# EAGLE design char (EAGLE 9.1.0)
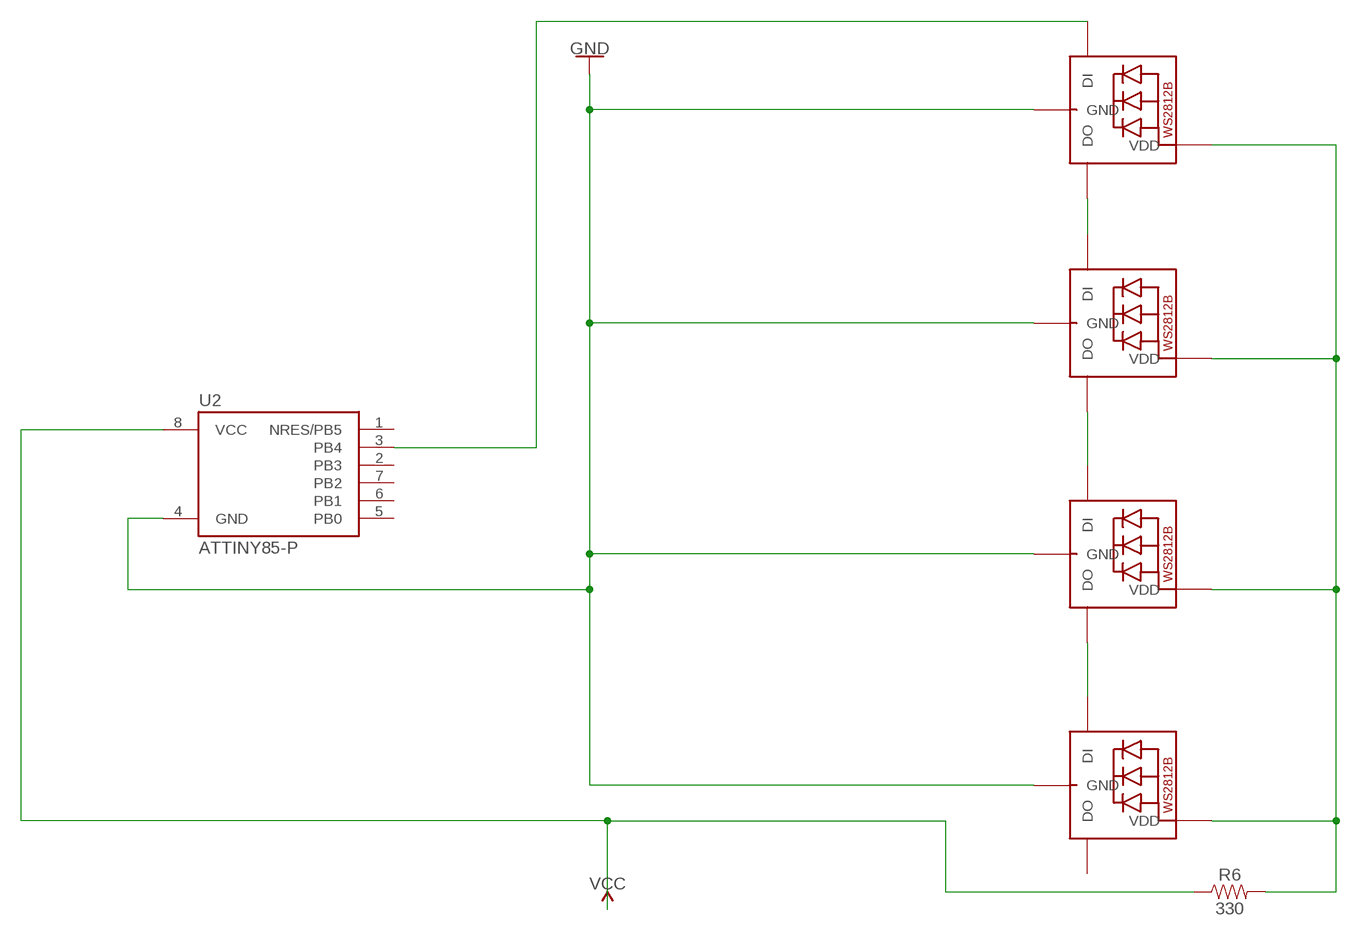
[diagram p0: schematic, sheet 1]

## Parts
R6  330  330OHM-HORIZ-1/10W-5%  [AXIAL-0.3]
U2  ATTINY85-P  [PDIP08_300MIL]
U$1  THROHOLE  [LED5MMRGB]
U$2  THROHOLE  [LED5MMRGB]
U$3  THROHOLE  [LED5MMRGB]
U$4  THROHOLE  [LED5MMRGB]

## Nets
GND: U2.4(GND) U$1.2(GND) U$2.2(GND) U$3.2(GND) U$4.2(GND)
N$1: U2.3(PB4) U$4.1(DI)
N$2: U$1.1(DI) U$4.4(DO)
N$3: U$1.4(DO) U$2.1(DI)
N$4: U$2.4(DO) U$3.1(DI)
N$5: R6.P$2 U$1.3(VDD) U$2.3(VDD) U$3.3(VDD) U$4.3(VDD)
VCC: R6.P$1 U2.8(VCC)
Unconnected: U2.1(NRES/PB5) U2.2(PB3) U2.5(PB0) U2.6(PB1) U2.7(PB2) U$3.4(DO)

## Library data of the parts
R6 = SparkFun-Resistors:330OHM: 330Ω resistor A resistor is a passive two-terminal electrical component that implements electrical resistance as a circuit element. Resistors act to reduce current flow, and, at the same time, act to lower voltage levels within circuits. - Wikipedia; PROD_ID: RES-8371
U2 = _hhn_attiny25_45_85:ATTINY85*: ATMEL ATtiny 85 Packages: P = PDIP 08 30mil S = SOIC 08 EIAJ 208mil Technologies Note: for complete ordering code (temp. range, finish, tape&reel etc.) see www.atmel.com • Supply Voltage: V = (1.8…5.5)V | [blank] = (2.7…5.5)V • Speed: 10 = 10 MHz | 20 = 20 MHz Author: Dipl.-Ing. FH Rainer Bayer HHN Hochschule Heilbronn (Heilbronn University), rainer.bayer@hs-heilbronn.de Ingenieurbüro ing-rb, mail@ing-rb.de
U$1-U$4 = neopixalthrohole:THROHOLE

## Board
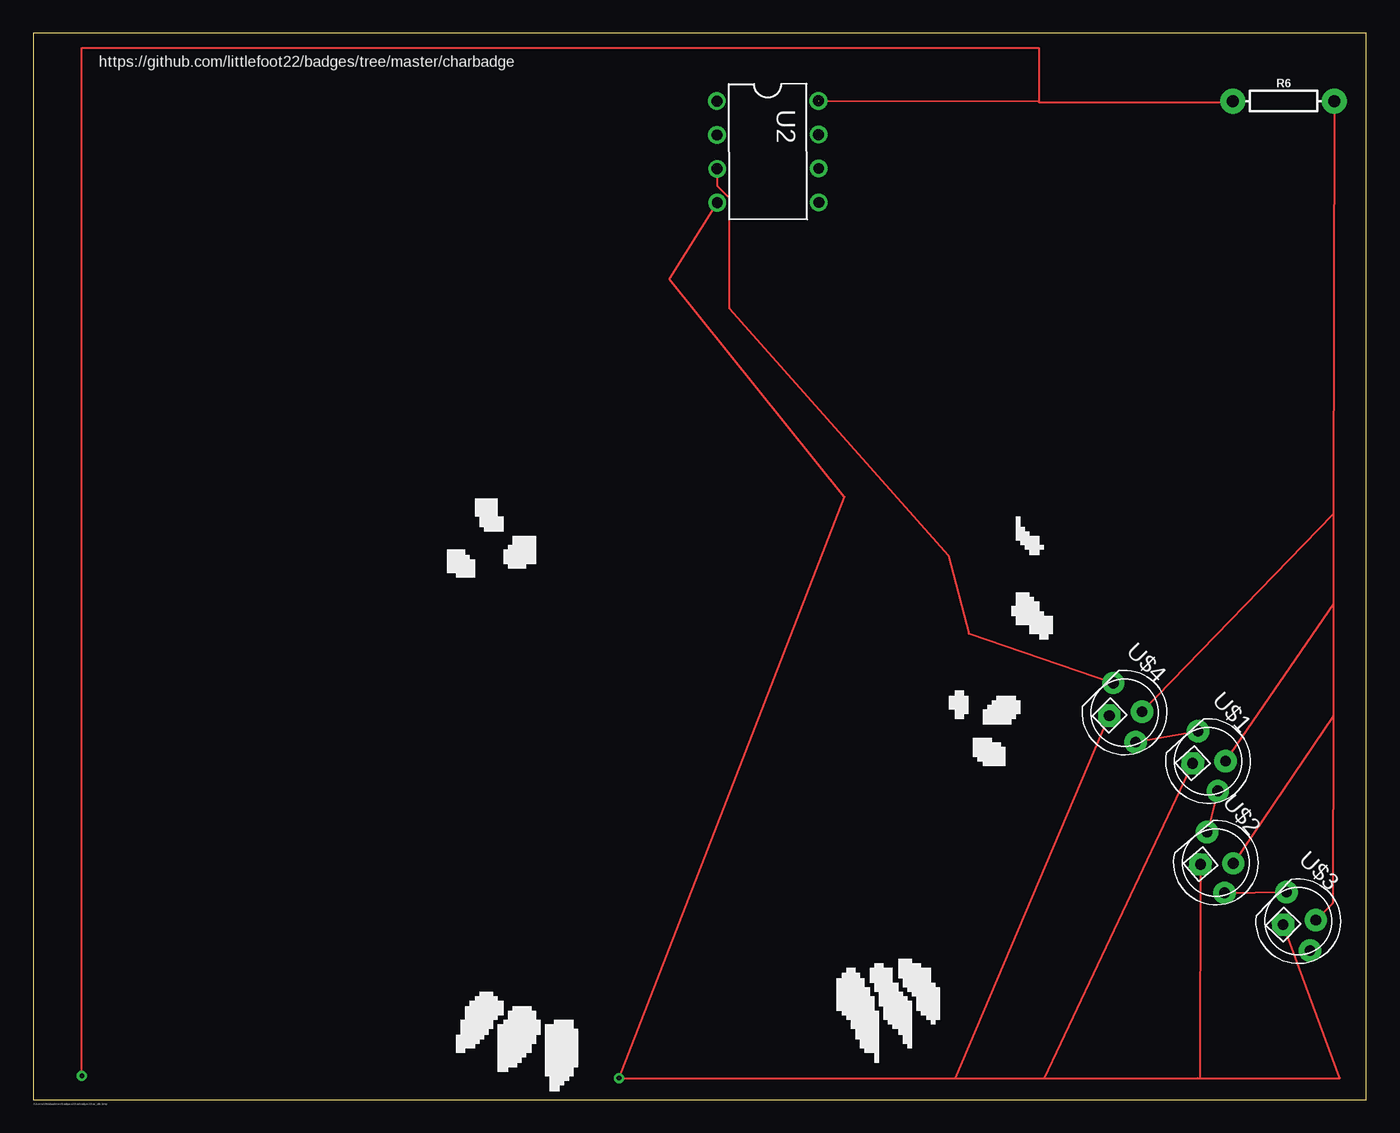
[diagram p1: board, top side]

Size 100 x 80 mm. Coordinates in mm from the lower left corner, seen from the top.
Outline: 0,0 100,0 100,80 0,80 0,0
Copper layers (1*16): Top 0.035mm / dielectric 1.5mm / Bottom 0.035mm
Design rules "default": minimum track width 6mil, minimum drill 0.35mm, track to track 6mil, track to pad 6mil, pad to pad 6mil, via to via 6mil, smd to smd 6mil, copper to edge 40mil, drill to drill 6mil, minimum pad ring 10mil, minimum via ring 8mil, stop-mask expansion 4mil, vias tented up to drill 0mil, thermal gap 10mil
tRestrict: area 38.4,0.3 to 39.8,0.4; area 38.4,0.4 to 39.8,0.5; area 38.4,0.5 to 39.8,0.6; area 38.4,0.6 to 39.8,0.6; area 38.4,0.6 to 40.2,0.7; area 38.4,0.7 to 40.2,0.8; area 38.4,0.8 to 40.2,0.9; area 38.4,0.9 to 40.2,1; area 38.4,1 to 40.2,1.1; area 38.4,1.1 to 40.5,1.1; area 38.4,1.1 to 40.5,1.2; area 38.4,1.2 to 40.5,1.3; 2397 more areas

### Footprints (pad centres in the part's own frame; a part is rotated, then mirrored left to right if it is on the bottom)
AXIAL-0.3 = drill 0.9 pad 1.88: P$1 -3.81,0; P$2 3.81,0
PDIP08_300MIL = drill 0.813: 1 -3.81,-3.81; 2 -1.27,-3.81; 3 1.27,-3.81; 4 3.81,-3.81; 5 3.81,3.81; 6 1.27,3.81; 7 -1.27,3.81; 8 -3.81,3.81
LED5MMRGB = drill 0.8 pad 1.676: 1 -2.159,0.968; 3 0.889,0.968; 4 2.159,-0.968 | drill 0.8 pad 1.676 octagon: 2 -0.635,-0.968

### Placement (x,y rotation side)
R6  93.8,74.92 0 top
U2  55.11,71.11 270.2 top
U$1  88.13,25.4 312.4 top
U$2  88.72,17.78 310.1 top
U$3  94.9,13.38 316.1 top
U$4  81.86,29.04 314.8 top

### Tracks (layer width: path | path; a pad name or v marks a point on that pad's centre or on a via)
GND  (via drill 0.35)
  Top 0.152: 69.17,1.61 v43.94,1.61 60.87,45.21 47.75,61.55 U2.4 | 69.17,1.61 75.85,1.61 | 75.85,1.61 87.37,1.61 87.54,1.61 | 87.54,1.61 98.03,1.61 U$3.2 | 69.17,1.61 U$4.2 | 75.85,1.61 U$1.2 | U$2.2 87.54,1.61
N$1
  Top 0.152: U2.3 51.3,68.56 52.2,67.66 52.2,59.38 52.23,59.34 68.66,40.8 70.18,34.96 U$4.1
N$2
  Top 0.152: U$4.4 U$1.1
N$3
  Top 0.152: U$1.4 U$2.1
N$4
  Top 0.152: U$2.4 U$3.1
N$5
  Top 0.152: R6.P$2 97.55,43.94 | 97.55,43.94 97.53,37.16 | 97.53,37.16 97.52,28.78 | 97.52,28.78 97.49,14.73 U$3.3 | 97.53,37.16 U$1.3 | 97.52,28.78 U$2.3 | 97.55,43.94 U$4.3
VCC  (via drill 0.35)  (1 unrouted)
  Top 0.152: 58.92,74.92 | 75.43,74.92 75.43,78.91 3.64,78.91 v3.64,1.78 | 75.43,74.92 75.43,74.84 | 75.43,74.84 89.91,74.84 R6.P$1 | 75.43,74.84 | U2.8 75.43,74.92

### Text on the board
tPlace: https://github.com/littlefoot22/badges/tree/master/charbadge | /Users/chrisbuckner/badges/charbadge/char_silk.bmp
tStop: /Users/chrisbuckner/badges/charbadge/char_copper.bmp